# EAGLE design working (EAGLE 9.6.2)
COMPANY: ADAFRUIT INDUSTRIES; DRAWN: KTOWN; REV: A
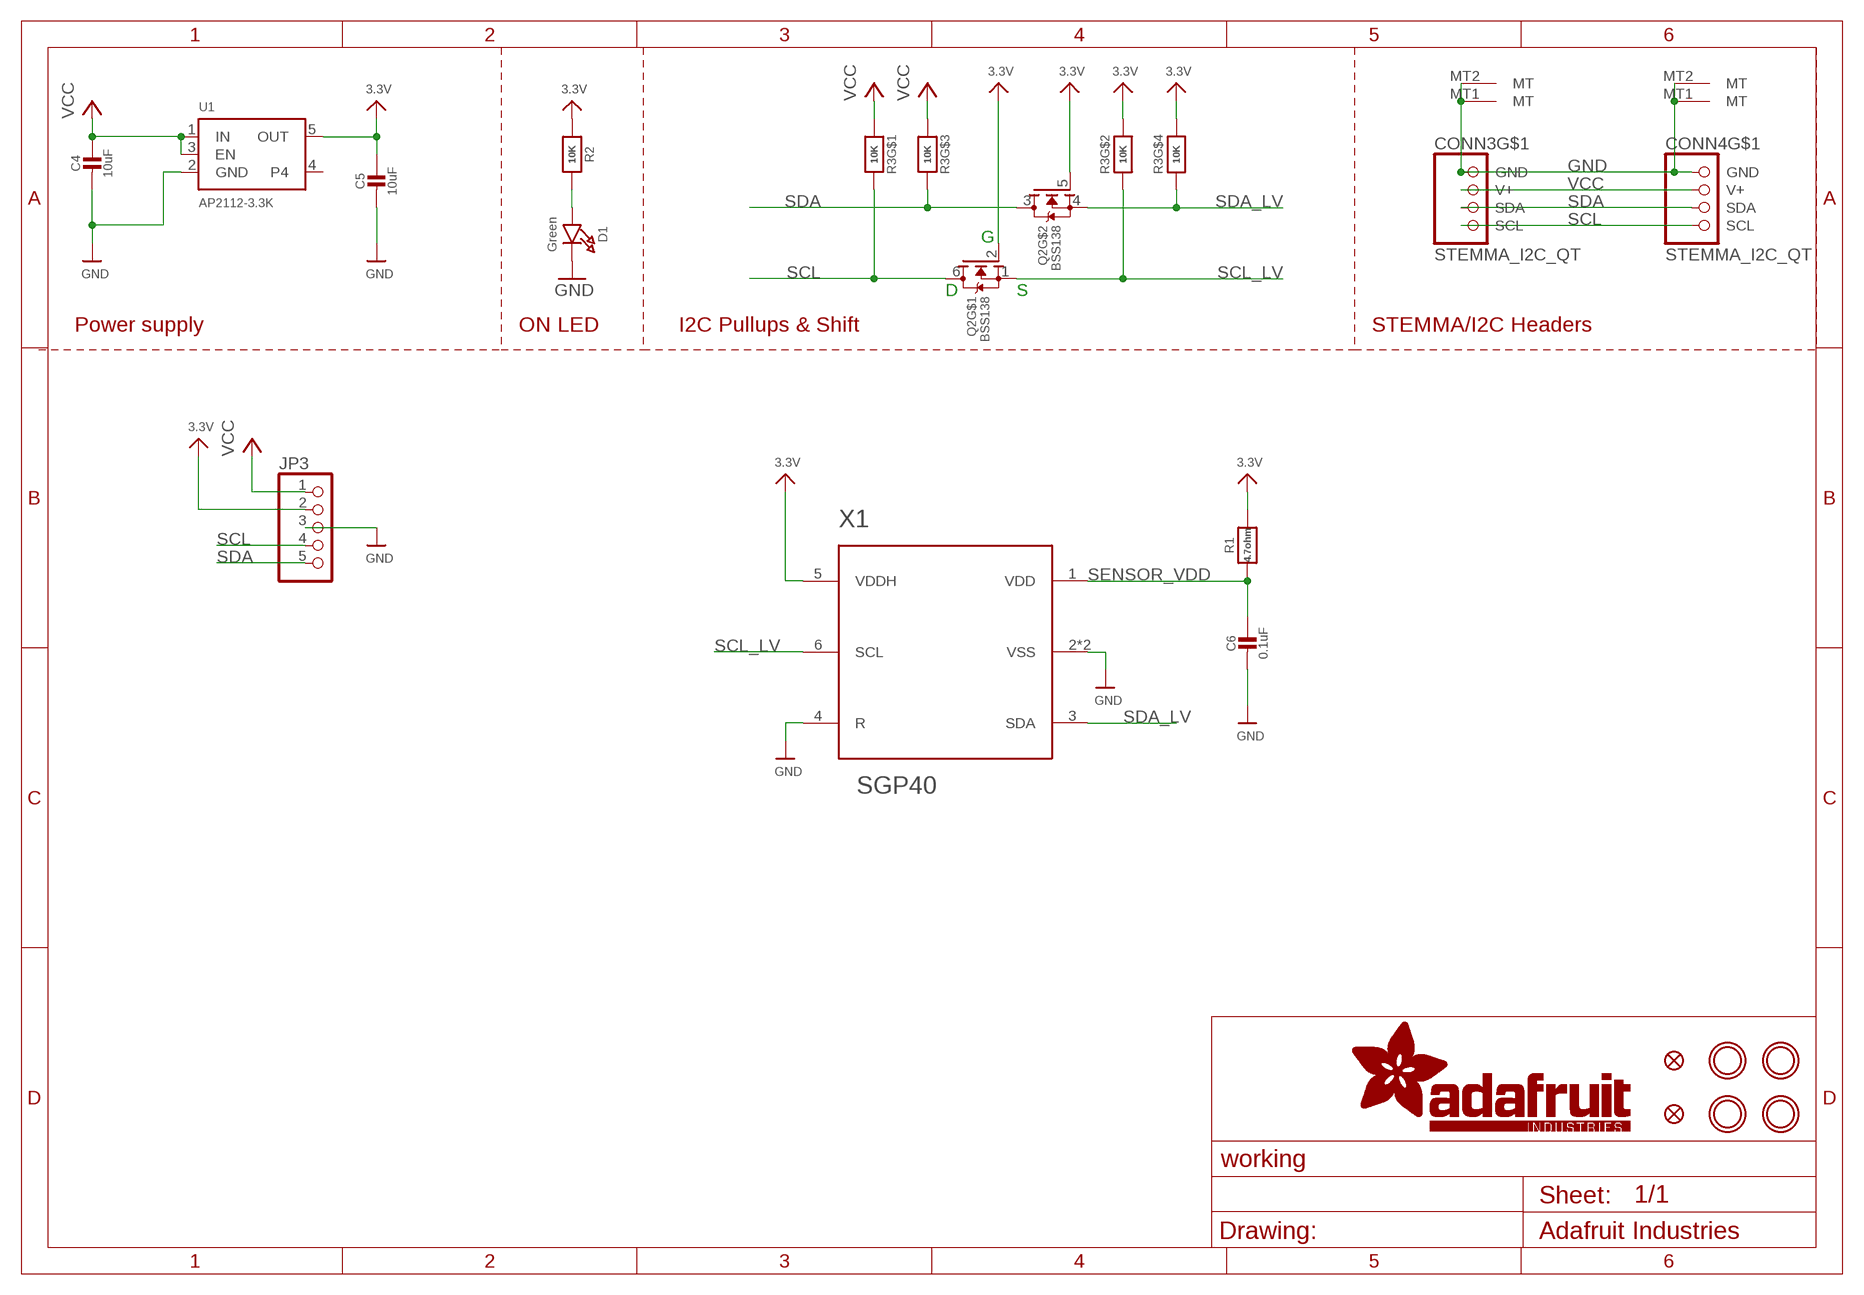
[diagram p0: schematic, sheet 1]

## Parts
C4  10uF  CAP_CERAMIC0805-NOOUTLINE  [0805-NO]
C5  10uF  CAP_CERAMIC0805-NOOUTLINE  [0805-NO]
C6  0.1uF  CAP_CERAMIC0603_NO  [0603-NO]
CONN3  STEMMA_I2C_QT  [JST_SH4]
CONN4  STEMMA_I2C_QT  [JST_SH4]
D1  Green  LED0603_NOOUTLINE  [CHIPLED_0603_NOOUTLINE]
FID3  FIDUCIAL_1MM  [FIDUCIAL_1MM]
FID4  FIDUCIAL_1MM  [FIDUCIAL_1MM]
JP3  HEADER-1X570MIL  [1X05_ROUND_70]
Q2  BSS138  MOSFET-N_DUAL  [SOT363]
R1  4.7ohm  RESISTOR_0603_NOOUT  [0603-NO]
R2  10K  RESISTOR_0603_NOOUT  [0603-NO]
R3  10K  RESISTOR_4PACK  [RESPACK_4X0603]
U1  AP2112-3.3K  VREG_SOT23-5  [SOT23-5]
U$28  MOUNTINGHOLE2.5  [MOUNTINGHOLE_2.5_PLATED]
U$29  MOUNTINGHOLE2.5  [MOUNTINGHOLE_2.5_PLATED]
U$31  MOUNTINGHOLE2.5  [MOUNTINGHOLE_2.5_PLATED]
U$32  MOUNTINGHOLE2.5  [MOUNTINGHOLE_2.5_PLATED]
X1  SGP40  SGP30  [SGP30]

## Nets
3.3V [lowpower]: C5.1 JP3.2 Q2.2(G) Q2.5(G) R1.2 R2.1 R3.2 R3.4 U1.5(OUT) X1.5(VDDH)
GND: C4.2 C5.2 C6.2 CONN3.1(GND) CONN3.MT1(MT) CONN3.MT2(MT) CONN4.1(GND) CONN4.MT1(MT) CONN4.MT2(MT) D1.C JP3.3 U1.2(GND) X1.2(VSS) X1.4(R) X1.P$7(VSS)
N$1: D1.A R2.2
SCL: CONN3.4(SCL) CONN4.4(SCL) JP3.4 Q2.6(D) R3.8
SCL_LV: Q2.1(S) R3.7 X1.6(SCL)
SDA: CONN3.3(SDA) CONN4.3(SDA) JP3.5 Q2.3(D) R3.6
SDA_LV: Q2.4(S) R3.5 X1.3(SDA)
SENSOR_VDD [lowpower]: C6.1 R1.1 X1.1(VDD)
VCC [highpower]: C4.1 CONN3.2(V+) CONN4.2(V+) JP3.1 R3.1 R3.3 U1.1(IN) U1.3(EN)
Unconnected: U1.4

## Notes on the sheet
- G
- D | S
- Power supply | ON LED | I2C Pullups & Shift | STEMMA/I2C Headers

## Library data of the parts
C4-C6 = microbuilder:CAP_CERAMIC: Ceramic Capacitors For new designs, use the packages preceded by an '_' character since they are more reliable: The following footprints should be used on most boards: _0402 - Standard footprint for regular board layouts _0603 - Standard footprint for regular board layouts _0805 - Standard footprint for regular board layouts _1206 - Standard footprint for regular board layouts For extremely tight-pitch boards where space is at a premium, the following 'micro-pitch' footprints can be used (smaller pads, no silkscreen outline, etc.): _0402MP - Micro-pitch footprint for very dense/compact boards _0603MP - Micro-pitch footprint for very dense/compact boards _0805MP - Micro-pitch footprint for very dense/compact boards _1206MP - Micro-pitch footprint for very dense/compact boards
CONN3 CONN4 = microbuilder:STEMMA_I2C
D1 = microbuilder:LED: LED 0603 - 0603 Surface Mount Package 2mA: Green LED - Low Power (3.9mcd, 2ma, 1.7Vf) - Digikey: 475-2709-2-ND Orange LED - Low Power (9.8mcd, 2ma, 1.8Vf) - Digikey: 475-1194-2-ND Red LED - Low Power (5mcd, 2ma, 1.8Vf) - Digikey: 475-1195-2-ND Yellow LED - Low Power (7mcd, 2ma, 1.8Vf) - Digikey: 475-1196-2-ND 5mA: Blue LED - Low Power (17mcd, 5ma, 2.9Vf) - Digikey: LNJ937W8CRACT-ND 0805 - 0805 Surface Mount Package 2mA: Red LED (8.8mcd, 2mA, 1.8Vf, Clear) - Low Power [Digikey: 475-2510-1-ND] Green LED (5mcd, 2mA, 1.8Vf, Clear) - Low Power [Digikey: 475-2730-1-ND] Yellow LED (11.3mcd, 2mA, 1.8Vf, Clear) - Low Power [Digikey: 475-2555-1-ND] 20mA: Red LED (104mcd, 20mA, Diffused) - LS R976 [Digikey: 475-1278-6-ND] Red LED (12mcd, 20mA, 2.0Vf, Clear) - APT2012EC [Digikey: 754-1128-1-ND] Green LED (15mcd, 20mA, 2.2Vf, Clear) - APT2012GC [Digikey: 754-1131-1-ND] Orange LED (160mcd, 20mA, 2.1Vf, Clear) - APT2012SECK [Digikey: 754-1130-1-ND] 1206 - 1206 Surface Mount Package Green LED (26mcd, 20mA, Diffused) - LG N971 [Digikey: 475-1407-6-ND] Red LED (15mcd, 20mA, Diffused) - LH N974 [Digikey: 475-1416-6-ND] Cree - Cree High-Power Surface Mount LEDs XPEBWT-L1-0000-00D50 - White 111lm 350mA 2.9Vf 6200K 110° XTEAWT-00-0000-00000LEE3 - White 114lm 350mA 2.85Vf 5000K 115° Everlight - Everlight 45-21 Series Surface Mount LEDs 45-21/QK2C-B2832AC2CB2/2T - Warm White 2000mcd 20mA 3.25Vf 3050K 120° 45-21/LK2C-B38452C4CB2/2T - Nuetral White 2000mcd 20mA 3.25Vf 4150K 120° 45-21/LK2C-B50634C6CB2/2T - Cold White 2200mcd 20mA 3.25Vf 5650K 120° PLCC2 Reverse Mount LS T77K-J1L2-1-0-2-R18-Z - Red 11.25mcd 2mA 1.8Vf 630nm 120° LO T77K-L1M2-24-Z - Orange 19.6mcd 2mA 1.8Vf 606nm 120° LY T77K-K2M1-26-Z - Yellow 15.7mcd 2mA 1.8Vf 587nm 120°
FID3 FID4 = microbuilder:FIDUCIAL: Fiducial Alignment Points Various fiducial points for machine vision alignment.; BOM: EXCLUDE
JP3 = microbuilder:HEADER-1X5: PIN HEADER
Q2 = microbuilder:MOSFET-N_DUAL: Dual N-Channel MOSFET SOT363 (2.0x1.25mm) 2N7002PS - 60V, 320mA [Digikey: 568-5984-1-ND]
R1 R2 = microbuilder:RESISTOR: Resistors For new designs, use the packages preceded by an '_' character since they are more reliable: The following footprints should be used on most boards: _0402 - Standard footprint for regular board layouts _0603 - Standard footprint for regular board layouts _0805 - Standard footprint for regular board layouts _1206 - Standard footprint for regular board layouts For extremely tight-pitch boards where space is at a premium, the following 'micro-pitch' footprints can be used (smaller pads, no silkscreen outline, etc.): _0402MP - Micro-pitch footprint for very dense/compact boards _0603MP - Micro-pitch footprint for very dense/compact boards _0805MP - Micro-pitch footprint for very dense/compact boards _1206MP - Micro-pitch footprint for very dense/compact boards
R3 = microbuilder:RESISTOR_4PACK: Resistor Packs (4 resistors) 4 x 0603 10K 1/16W - Digikey: YC164J-10KCT-ND
U1 = microbuilder:VREG_SOT23-5: SOT23-5 Fixed Voltage Regulators Part Current Out V Out V In V Dropout θJA (°C/W) TJ (°C) Digikey Part No. ADP121 150mA 3.3V 3.4-5.5V 0.09V @ 150mA -- -- ADP121-AUJZ33R7CT-ND ADP121 150mA 3.0V 3.1-5.5V 0.09V @ 150mA -- -- ADP121-AUJZ30R7CT-ND ADP122 300mA 3.3V 3.4-5.5V 0.085V @ 300mA -- -- ADP122AUJZ-3.3-R7CT-ND ADP1712 300mA 3.3V 3.5-5.5V 0.17V @ 300mA -- -- ADP1712AUJZ-3.3-R7TR-ND AP7311 (Low Cost) 150mA 3.3V 3.5-6V 0.15V @ 150mA -- -- AP7311-33WG-7DICT-ND LD39015M18R 150mA 1.8V 1.9V-5.5V 0.08V @ 100mA -- -- 497-6977-1-ND LP2985A-33DBVR 150mA 3.3V 3.3-16V 0.28V @ 150mA 206 150 296-18479-1-ND MCP1824T-3302E/OT 300mA 3.3V 3.5V-6V 0.2V @ 300mA -- -- MCP1824T-3302E/OTCT-ND MIC5205-2.5YM5 TR 150mA 2.5V 2.7-16V 0.165V @ 150mA -- -- 576-1257-2-ND MIC5205-3.0YM5 TR 150mA 3.0V 3.2V-16V 0.165V @ 150mA -- -- 576-1258-2-ND MIC5205-3.3YM5 TR 150mA 3.3V 3.5V-16V 0.165V @ 150mA -- -- 576-1259-2-ND TPS780330220 150mA 3.3V+2.2V 3.6-5.5V 250mV Max -- -- 296-23332-1-ND TDA3663/N1,135 100mA 3.3V 3.5-45V 0.18V @ 50mA -- -- 568-5343-1-ND Max operating temp can be calculated using θJA, TJ (max junction temperature), and power in watts. Set the "Maximum Ambient Temperature" until it reaches TJ ("Max Junction Temperature"), which is the absolute limit for safe use of the regulator: Heat Sink Temperature Calculator <http://www.daycounter.com/Calculators/Heat-Sink-Temperature-Calculator.phtml> For example, With 12V source into a 3.3V LP2985 and a 30mA load, we are dissipating (12V-3.3V) * 0.03A = 0.261W. With a θJA of 206 °C/W, a TJ of 150°C, and 261mW we can safely use the chip without a heat sink up to 75°C (=147.1°C Junction Temperature).
U$28 U$29 U$31 U$32 = microbuilder:MOUNTINGHOLE: Mounting Hole For #2 screws (0.086"/2.18mm width, 0.094"/2.4mm hole) use 2.5mm; BOM: EXCLUDE
X1 = microbuilder:SGP30: Sensirion SGP30 multi-pixel gas sensor

## Net classes
1 highpower: width 0.305 mm, drill 0.483 mm
2 lowpower: width 0.254 mm, drill 0.483 mm

## Board
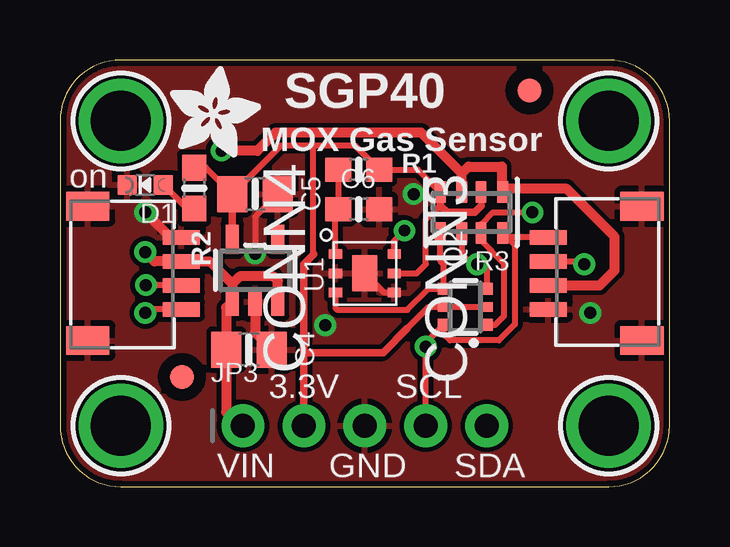
[diagram p1: board, top side]
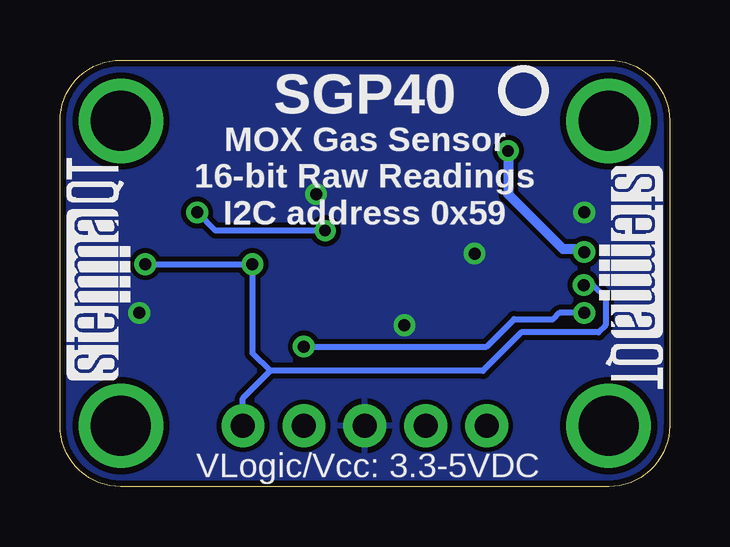
[diagram p2: board, bottom side, seen from below]

Size 25.4 x 17.78 mm. Coordinates in mm from the lower left corner, seen from the top.
Outline: 0,15.24 0,2.54 arc90 2.54,0 22.86,0 arc90 25.4,2.54 25.4,15.24 arc90 22.86,17.78 2.54,17.78 arc90 0,15.24
Copper layers (1*16): Top 0.035mm / dielectric 1.5mm / Bottom 0.035mm
Design rules "adafruit *": minimum track width 8mil, minimum drill 15.5mil, track to track 8mil, track to pad 8mil, pad to pad 8mil, via to via 8mil, smd to smd 8mil, copper to edge 10mil, drill to drill 8mil, minimum pad ring 10mil, minimum via ring 8mil, stop-mask expansion 2mil, vias tented up to drill 20mil, thermal gap 10mil

### Footprints (pad centres in the part's own frame; a part is rotated, then mirrored left to right if it is on the bottom)
0805-NO = smd 1.24 x 1.5: 1 -0.95,0; 2 0.95,0
0603-NO = smd 1.075 x 1: 1 -0.85,0; 2 0.85,0
JST_SH4 = smd 0.6 x 1.55: 1 -1.5,2.514; 2 -0.5,2.514; 3 0.5,2.514; 4 1.5,2.514 | smd 1.2 x 1.8: MT1 -2.8,-1.386; MT2 2.8,-1.386
CHIPLED_0603_NOOUTLINE = smd 0.8 x 0.8: A 0,-0.75; C 0,0.75
FIDUCIAL_1MM = smd 1 x 1: 1 0,0
1X05_ROUND_70 = drill 1 pad 1.778: 1 -5.08,0; 2 -2.54,0; 3 0,0; 4 2.54,0; 5 5.08,0
SOT363 = smd 0.5 x 0.5: 1 -0.75,-0.9; 3 0.75,-0.9; 4 0.75,0.9; 6 -0.75,0.9 | smd 0.4 x 0.5: 2 0,-0.9; 5 0,0.9
RESPACK_4X0603 = smd 0.45 x 0.9: 1 -1.3,-0.85; 2 -0.4,-0.85; 3 0.4,-0.85; 4 1.3,-0.85; 5 1.3,0.85; 6 0.4,0.85; 7 -0.4,0.85; 8 -1.3,0.85
SOT23-5 = smd 0.55 x 1.2: 1 -0.95,-1.3; 2 0,-1.3; 3 0.95,-1.3; 4 0.95,1.3; 5 -0.95,1.3
MOUNTINGHOLE_2.5_PLATED = drill 2.5 pad 3.2: P$1 0,0
SGP30 = smd 0.55 x 0.4: 1 -1.225,0.8; 2 -1.225,0; 3 -1.225,-0.8; 4 1.225,-0.8; 5 1.225,0; 6 1.225,0.8 | smd 1.05 x 1.5: P$7 0,0

### Placement (x,y rotation side)
C4  7.87,5.71 0 top
C5  8.13,12.19 0 top
C6  12.45,11.56 0 top
CONN3  22.86,8.89 90 top
CONN4  2.54,8.89 270 top
D1  3.56,12.57 90 top
FID3  5.08,4.57 0 top
FID4  19.56,16.51 0 top
JP3  12.7,2.54 0 top
Q2  16.89,7.49 90 top
R1  12.45,13.21 0 top
R2  5.59,12.45 270 top
R3  17.14,11.43 180 top
U1  8.13,9.02 0 top
U$28  2.54,15.24 0 top
U$29  22.86,15.24 0 top
U$31  2.54,2.54 0 top
U$32  22.86,2.54 0 top
U$34  [ADAFRUIT_3.5MM]  4.57,13.72 0 top
U$35  [PCBFEAT-REV-040]  6.1,16.51 0 bottom
U$36  [STEMMAQT]  22.48,4.45 90 bottom
U$37  [STEMMAQT]  2.92,13.34 270 bottom
X1  12.7,8.89 0 top

### Tracks (layer width: path | path; a pad name or v marks a point on that pad's centre or on a via)
3.3V
  Top 0.254: X1.5 14.86,8.89 15.24,9.27 15.24,11.12 15.48,11.36 15.49,11.36 15.85,11.71 | JP3.2 10.16,2.92 | 14.48,6.6 15.37,7.49 Q2.5 Q2.2 | R2.1 6.07,13.3 C5.1 9.21,14.22 10.67,14.22 | R3.4 14.92,13.21 R1.2 12.28,14.22 10.67,14.22 | 10.67,14.22 10.54,14.1 10.54,9.73 10.58,9.69 | R3.2 17.55,11.7
  Top 0.305: C5.1 U1.5 | 17.55,11.7 17.27,11.43 16.13,11.43 15.85,11.71 R3.4 | 10.16,5.59 10.16,9.27 10.58,9.69 | 10.16,5.59 10.16,2.92 | 10.16,5.59 13.46,5.59 14.48,6.6
GND  (via drill 0.5)
  Top 0.254: X1.4 13.5,8.09 X1.P$7 | C5.2 8.13,11.24 v8.13,9.72
  Top 0.406: U1.2 8.13,6.41 C4.2 | CONN4.1 4.6,10.39 v3.56,11.43
  other vias: 22.1,7.24 11.05,6.73 14.73,12.19
  pour Top: 0,17.78 25.4,17.78 25.4,0 0,0
  pour Bottom: 0,17.78 25.4,17.78 25.4,0 0,0
N$1
  Top 0.254: D1.A 5.28,11.6 R2.2
SCL  (via drill 0.5)
  Top 0.254: CONN3.4 18.64,10.39 R3.8 18.95,10.07 18.95,6.76 18.29,6.1 16.26,6.1 15.99,6.36 Q2.6 15.24,5.99 v15.24,5.84 15.24,2.79 | CONN4.4 3.71,7.39 v3.56,7.24
  Top 0.305: JP3.4 15.24,2.79
  Bottom 0.254: v15.24,5.84 7.62,5.84 6.48,6.99 4.85,6.99 4.59,7.24 v3.56,7.24
SCL_LV  (via drill 0.48, 0.5)
  Top 0.254: v19.68,11.43 18.03,11.43 17.55,10.94 R3.7 17.55,10.27 18.5,9.32 18.5,7.11 18.13,6.74 Q2.1 | X1.6 13.93,10.24 v14.35,10.67
  Bottom 0.254: v14.35,10.67 18.92,10.67 v19.68,11.43
SDA  (via drill 0.5)
  Top 0.254: R3.6 16.75,9.69 17.16,9.27 v17.38,9.27 17.38,9.13 17.79,9.13 Q2.3 | CONN4.3 v3.58,8.39 v3.58,8.4 | CONN3.3 21.73,9.39 v21.84,9.27
  Bottom 0.254: v3.58,8.4 3.2,8.4 2.67,7.87 2.67,6.73 2.97,6.43 6.18,6.43 7.78,4.83 16.64,4.83 | v21.84,9.27 v17.38,9.27 17.38,5.57 16.64,4.83 | JP3.5 17.78,3.68 16.64,4.83
SDA_LV
  Top 0.254: R3.5 15.85,9.4 15.99,9.26 Q2.4 15.36,8.24 14.48,7.37 11.56,7.37 11.47,7.45 X1.3
SENSOR_VDD
  Top 0.254: R1.1 C6.1 11.47,11.44 X1.1
VCC  (via drill 0.48, 0.5)
  Top 0.406: R3.3 16.75,13.06 | 16.75,13.06 17.02,13.34 18.41,13.34 18.41,12.31 R3.1 18.57,12.41 21.12,12.41 23.11,10.41 23.11,9.02 22.49,8.39 CONN3.2 | U1.3 9.08,8.57 8.89,8.76 7.49,8.76 7.18,8.45 | 7.18,8.45 U1.1 6.92,7.46 C4.1 6.92,3.11 7.5,2.54 JP3.1 | 7.18,8.45 6.24,9.39 CONN4.2 3.94,9.39 v3.56,9.78 | v6.73,13.99 8.23,13.99 8.99,14.76 15.05,14.76 16.75,13.06
  Bottom 0.406: v3.56,9.78 3.56,9.91 4.45,9.91 6.73,12.19 v6.73,13.99

### Text on the board
tPlace: SGP40 | MOX Gas Sensor | on | 3.3V | SCL | VIN | GND | SDA
bPlace: SGP40 | MOX Gas Sensor / 16-bit Raw Readings / I2C address 0x59 | VLogic/Vcc: 3.3-5VDC